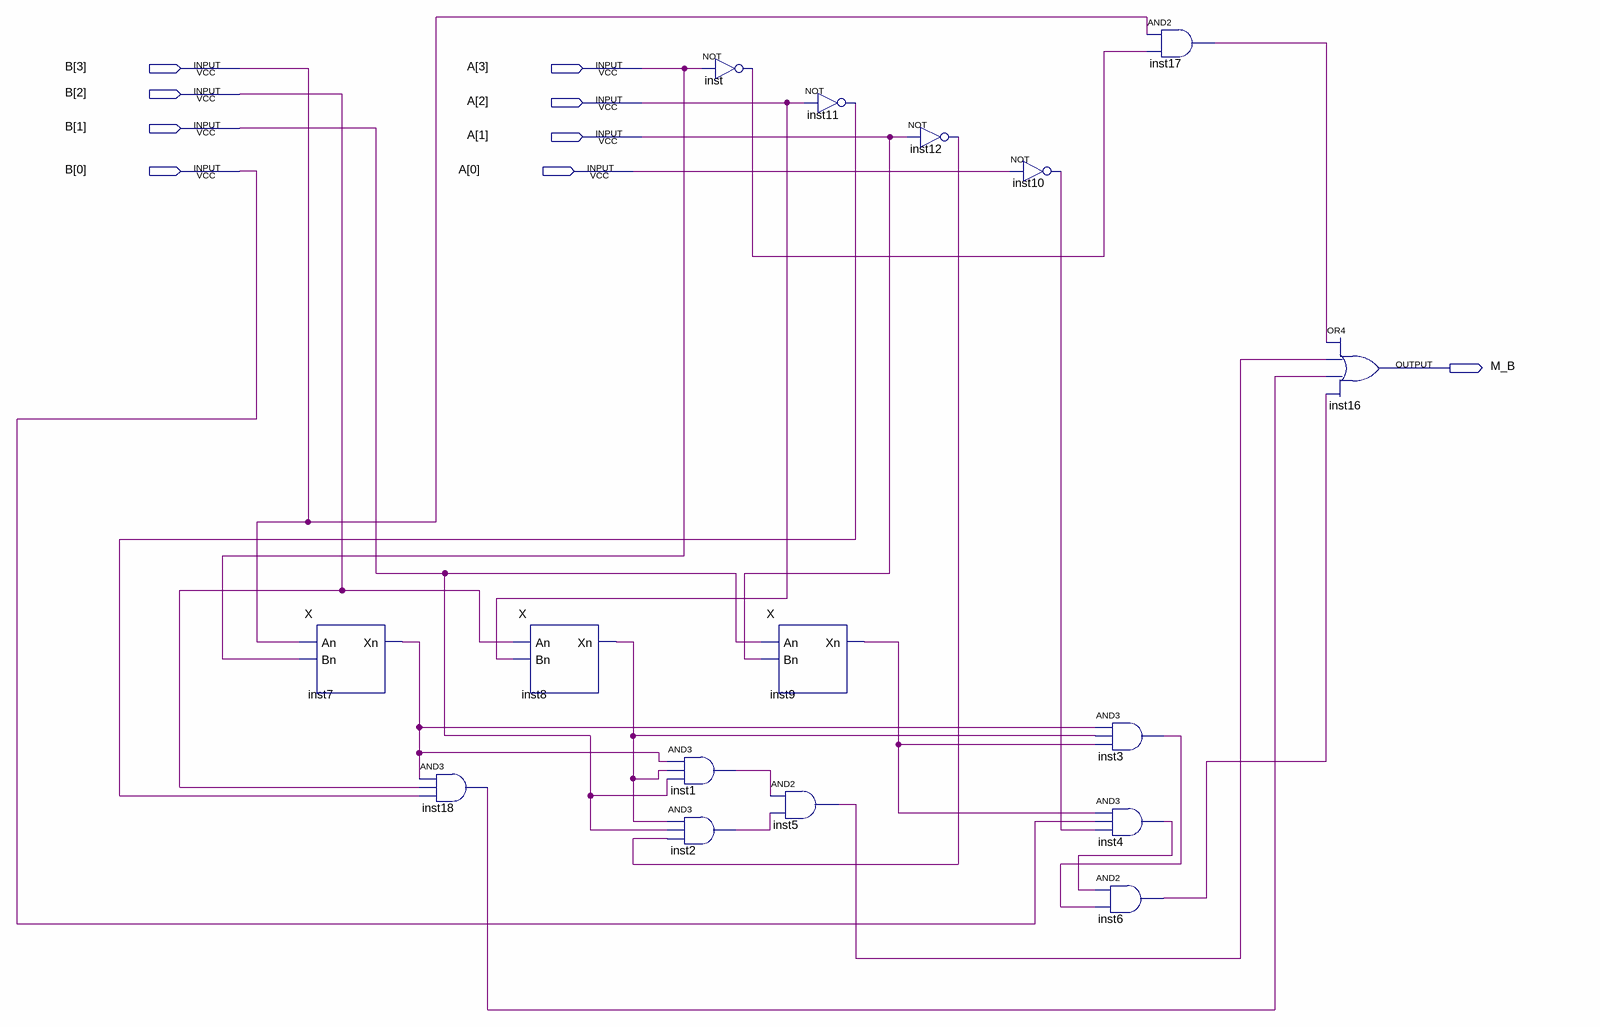
[diagram p0: schematic sheet]
// Quartus schematic bmaiorquea.bdf as structural Verilog: 16 symbols, 9 pins
module bmaiorquea (
  input  [3:0] B,
  input  [3:0] A,
  output M_B
);

  wire inst1_out, inst2_out, inst3_out, inst4_out, inst5_out, inst6_out, inst7_xn, inst8_xn, inst9_xn,
       inst10_out, inst11_out, inst12_out, inst17_out, inst18_out, inst_out;

  X inst7 (.An(B[3]), .Bn(A[3]), .Xn(inst7_xn));
  and inst18 (inst18_out, inst7_xn, B[2], inst11_out);
  X inst8 (.An(B[2]), .Bn(A[2]), .Xn(inst8_xn));
  not inst (inst_out, A[3]);
  and inst1 (inst1_out, inst7_xn, inst8_xn, B[1]);
  and inst2 (inst2_out, inst8_xn, B[1], inst12_out);
  X inst9 (.An(B[1]), .Bn(A[1]), .Xn(inst9_xn));
  and inst5 (inst5_out, inst1_out, inst2_out);
  not inst11 (inst11_out, A[2]);
  not inst12 (inst12_out, A[1]);
  not inst10 (inst10_out, A[0]);
  and inst3 (inst3_out, inst7_xn, inst8_xn, inst9_xn);
  and inst4 (inst4_out, inst9_xn, B[0], inst10_out);
  and inst6 (inst6_out, inst4_out, inst3_out);
  and inst17 (inst17_out, B[3], inst_out);
  or inst16 (M_B, inst17_out, inst5_out, inst18_out, inst6_out);
endmodule
